# Altium schematic sheet ArbPwrBoost_P3.SchDoc: =ProjectTitle
size B; Engineer: Hab Collector; Organization: Altium Limited; Address1: 3621 Gin Way; Address2: Snellville, GA 30039; SheetNumber: 3; SheetTotal: 8
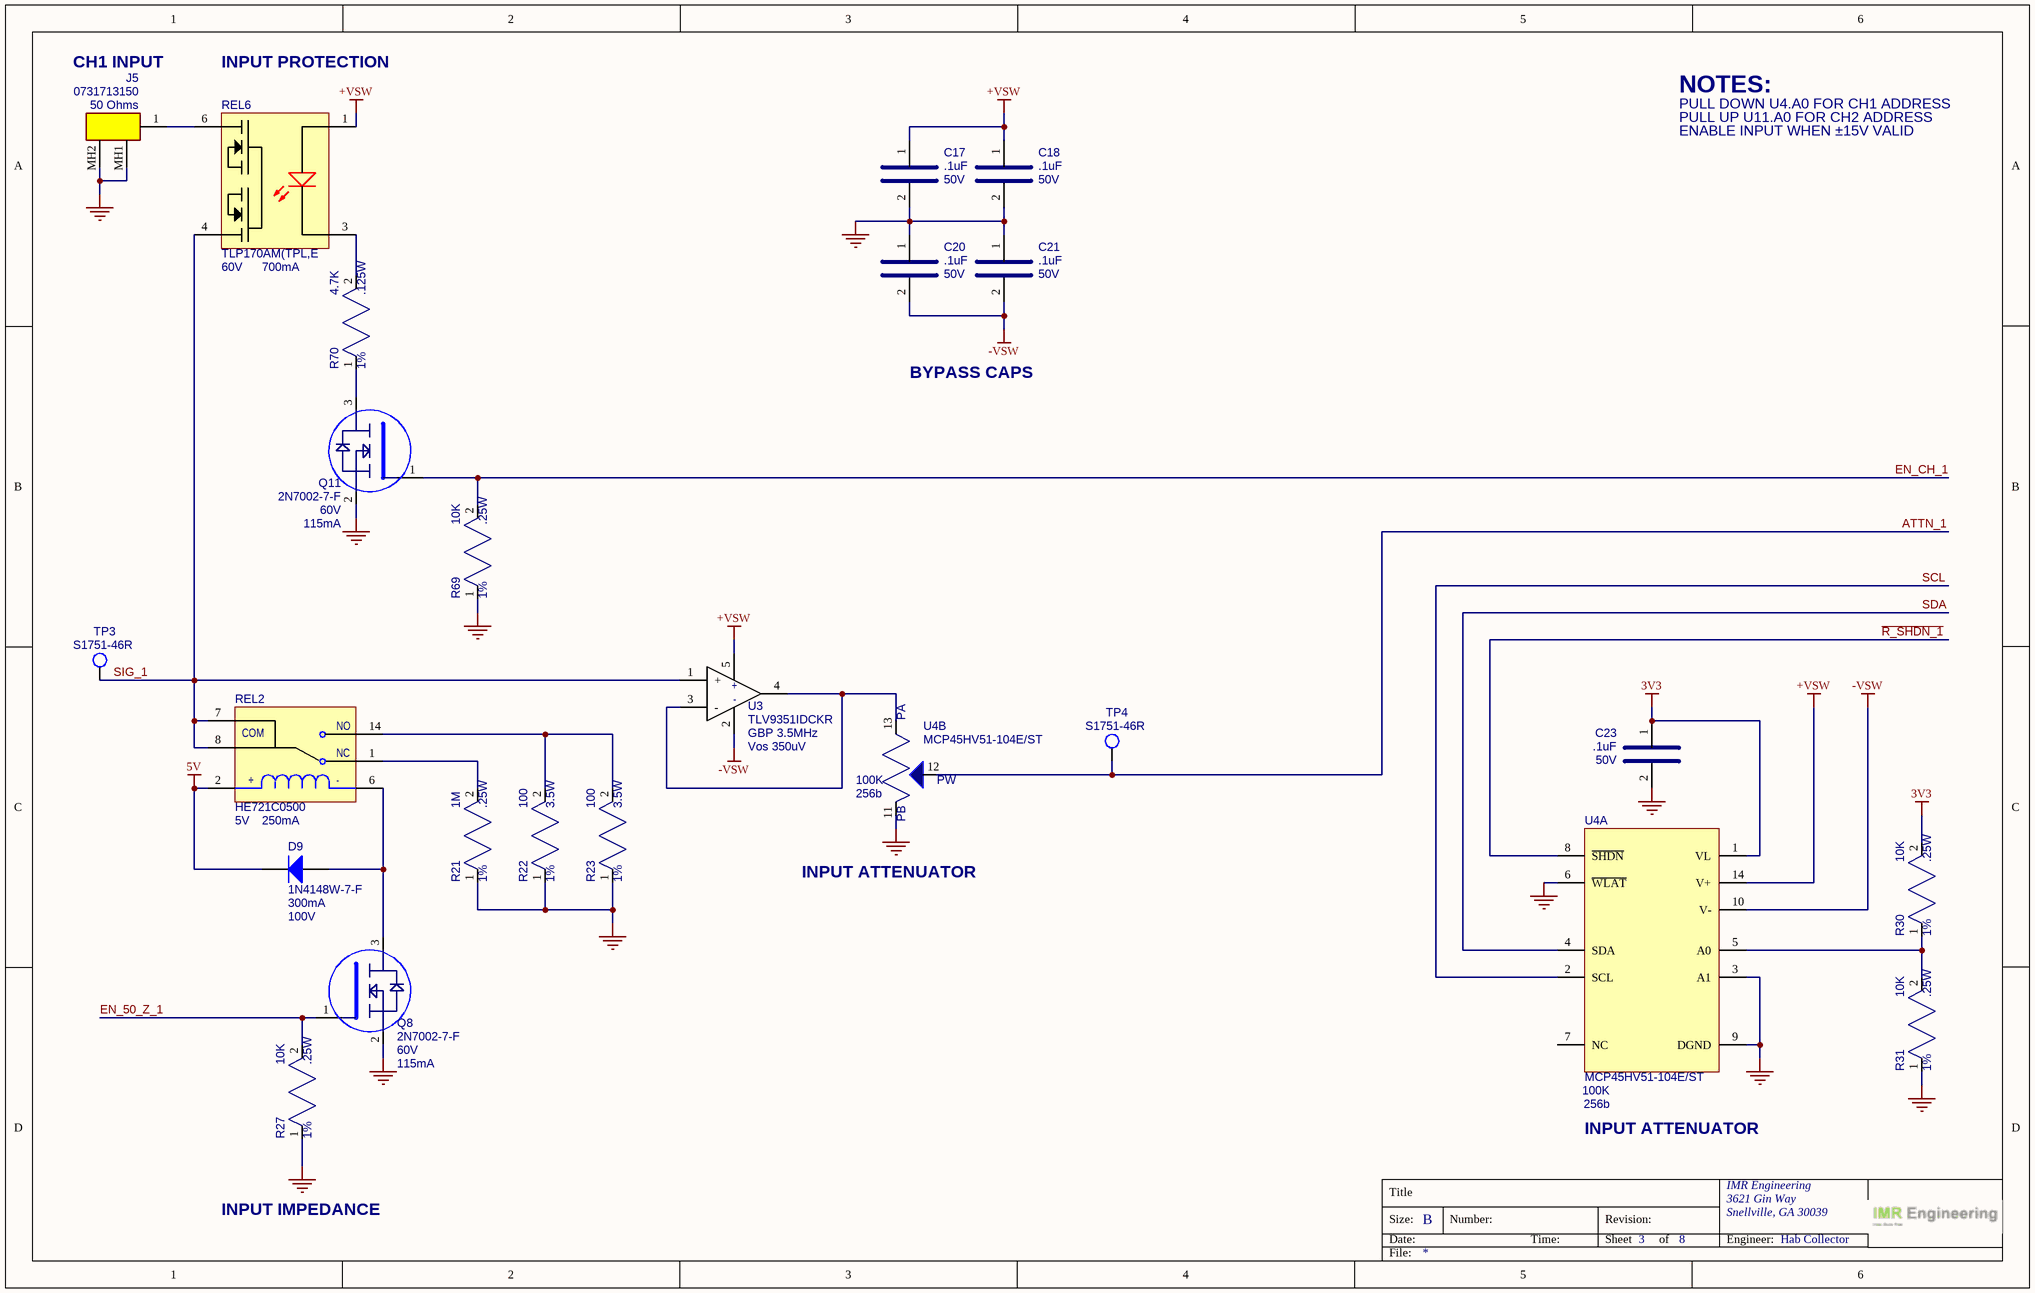
[diagram p0: ArbPwrBoost_P3.SchDoc]

## Parts
C17  value .1uF  Voltage: 50V  [CAP_0805]  (hidden comment: KGM21NR71H104KT)
C18  value .1uF  Voltage: 50V  [CAP_0805]  (hidden comment: KGM21NR71H104KT)
C20  value .1uF  Voltage: 50V  [CAP_0805]  (hidden comment: KGM21NR71H104KT)
C21  value .1uF  Voltage: 50V  [CAP_0805]  (hidden comment: KGM21NR71H104KT)
C23  value .1uF  Voltage: 50V  [CAP_0805]  (hidden comment: KGM21NR71H104KT)
D9  value 100V  Current: 300mA  [SOD123]  (hidden comment: 1N4148W-7-F)
J5  value 50 Ohms  [731713150]  (hidden comment: 0731713150)
Q8  value 60V  Current: 115mA  [SOT-23]  (hidden comment: 2N7002-7-F)
Q11  value 60V  Current: 115mA  [SOT-23]  (hidden comment: 2N7002-7-F)
R21  value 1M  Power: .25W  Tolerance: 1%  [RES_0805]  (hidden comment: RC0805FR-7W1ML)
R22  value 100  Power: 3.5W  Tolerance: 1%  [RES_2512]  (hidden comment: ALN2512F100RE-1)
R23  value 100  Power: 3.5W  Tolerance: 1%  [RES_2512]  (hidden comment: ALN2512F100RE-1)
R27  value 10K  Power: .25W  Tolerance: 1%  [RES_0805]  (hidden comment: RC0805FR-7W10KL)
R30  value 10K  Power: .25W  Tolerance: 1%  [RES_0805]  (hidden comment: RC0805FR-7W10KL)
R31  value 10K  Power: .25W  Tolerance: 1%  [RES_0805]  (hidden comment: RC0805FR-7W10KL)
R69  value 10K  Power: .25W  Tolerance: 1%  [RES_0805]  (hidden comment: RC0805FR-7W10KL)
R70  value 4.7K  Power: .125W  Tolerance: 1%  [RES_0805]  (hidden comment: RC0805FR-134K7L)
REL2  value 5V  Current: 250mA  [HE700]  (hidden comment: HE721C0500)
REL6  value 60V  Current: 700mA  [SOP-6]  (hidden comment: TLP170AM(TPL,E)
TP3  S1751-46R  [HARWIN_S1751]
TP4  S1751-46R  [HARWIN_S1751]
U3  value GBP 3.5MHz  Vos: Vos 350uV  [SOT-353]  (hidden comment: TLV9351IDCKR)
U4  value 100K  TAP: 256b  [TSSOP-14]  (hidden comment: MCP45HV51-104E/ST)  (parts A,B of 2)

## Nets
3V3: C23.1 R30.2 U4.1(VL)
5V: D9.2(K) REL2.2
+VSW: C17.1 C18.1 REL6.1 U3.5 U4.14(V+)
-VSW: C20.2 C21.2 U3.2 U4.10(V-)
GND: C17.2 C18.2 C20.1 C21.1 C23.2 J5.MH1 J5.MH2 Q8.2(E) Q11.2(E) R21.1 R22.1 R23.1 R27.1 R31.1 R69.1 U4.3(A1) U4.6(~{WLAT}) U4.9(DGND) U4.11(PB0)
~{R_SHDN_1}: U4.8(~{SHDN})
ATTN_1: TP4.1 U4.12(PW0)
EN_50_Z_1: Q8.1(B) R27.2
EN_CH_1: Q11.1(B) R69.2
SCL: U4.2(SCL)
SDA: U4.4(SDA)
SIG_1: REL2.7(COM) REL2.8(COM) REL6.4 TP3.1 U3.1(+)
NetD9_1: D9.1(A) Q8.3(C) REL2.6
NetJ5_1: J5.1 REL6.6
NetQ11_3: Q11.3(C) R70.1
NetR21_2: R21.2 REL2.1(NC)
NetR22_2: R22.2 R23.2 REL2.14(NO)
NetR30_1: R30.1 R31.2 U4.5(A0)
NetR70_2: R70.2 REL6.3
NetU3_3: U3.3(-) U3.4 U4.13(PA)

Not connected (* = marked no-connect by the designer): U4 7(NC)

## Notes on the sheet
- CH1 INPUT
- INPUT PROTECTION
- NOTES:
- PULL DOWN U4.A0 FOR CH1 ADDRESS
- PULL UP U11.A0 FOR CH2 ADDRESS
- ENABLE INPUT WHEN ±15V VALID
- BYPASS CAPS
- INPUT ATTENUATOR
- INPUT IMPEDANCE
- Title
- Size:
- Date:
- B
- Number:
- Time:
- Revision:
- Sheet
- of
- IMR Engineering
- Engineer:
- File:
- (in symbol IC_MCP45HV51-104E/ST, part B) PW; PB
- (in symbol RELAY_HE721C0500) +; -

## Library data of the parts
C17 C18 C20 C21 C23 = CAP_SMD_0.1UF_50V_0805: CAP CER 0.1UF 50V X7R 0805; MFG: KYOCERA AVX; Case/Package: 0805; MFG_PN: KGM21NR71H104KT; Supplier 1: DigiKey; Supplier Part Number 1: 478-KGM21NR71H104KTCT-ND; Unit Price: .1
D9 = DIODE_1N4148W-7-F: RELAY REED SPDT 250MA 5V; MFG: Diodes Inc; Case/Package: SOD-123; Supplier 1: DigiKey; Supplier Part Number 1: 1N4148W-FDICT-ND; Unit Price: .16; MFG_PN: 1N4148W-7-F
J5 = CONN_MOLEX_0731713150: CONN BNC RCPT R/A 50 OHM PCB; MFG: Molex; Case/Package: 73099-2; Supplier 1: DigiKey; Supplier Part Number 1: WM20430-ND; Unit Price: 1.40; MFG_PN: 0731713150
Q8 Q11 = MOSFET_NCH_2N7002-7-F: MOSFET N-CH 60V 115MA SOT23-3; MFG: Diodes Inc; Case/Package: SOT-23; Supplier 1: DigiKey; Supplier Part Number 1: 2N7002-FDICT-ND; Unit Price: .20; MFG_PN: 2N7002-7-F
R21 = RES_SMD_1M_0805_1/4W_1%: RES SMD 1K OHM 1% 1/4W 0805; MFG: Yageo; Case/Package: 0805; MFG_PN: RC0805FR-7W1ML; Supplier 1: DigiKey; Supplier Part Number 1: 13-RC0805FR-7W1MLCT-ND; Unit Price: .10
R22 R23 = RES_SMD_100_0805_3.5W_1%: RES SMD 100 OHM 1% 3.5W 2512; MFG: Ohmite; Case/Package: 2512; MFG_PN: ALN2512F100RE-1; Supplier 1: DigiKey; Supplier Part Number 1: 273-ALN2512F100RE-1CT-ND; Unit Price: 1.50
R27 R30 R31 R69 = RES_SMD_10K_0805_1/4W_1%: RES SMD 10K OHM 1% 1/4W 0805; MFG: Yageo; Case/Package: 0805; MFG_PN: RC0805FR-7W10KL; Supplier 1: DigiKey; Supplier Part Number 1: 13-RC0805FR-7W10KLCT-ND; Unit Price: .10
R70 = RES_SMD_4.7K_0805_1/8W_1%: RES SMD 4.7K OHM 1% 1/8W 0805; MFG: Yageo; Case/Package: 0805; MFG_PN: RC0805FR-134K7L; Supplier 1: DigiKey; Supplier Part Number 1: 13-RC0805FR-134K7LCT-ND; Unit Price: .1
REL2 = RELAY_HE721C0500: RELAY REED SPDT 250MA 5V; MFG: Littlefuse; Case/Package: HE700; Supplier 1: DigiKey; Supplier Part Number 1: HE112-ND; Unit Price: 3.77; MFG_PN: HE721C0500
REL6 = RELAY_TLP170AM(TPL,E: SSR RELAY SPST-NO 700MA 0-60V; MFG: Toshiba; Case/Package: SOP-6; Supplier 1: DigiKey; Supplier Part Number 1: 264-TLP170AM(TPLECT-ND; Unit Price: 1.33; MFG_PN: TLP170AM(TPL,E
TP3 TP4 = CONN_TEST_POINT_S1751-46R: PCB TEST POINT CONNECT; MFG: Harwin Inc; Case/Package: S1751; MFG_PN: S1751-46R; Supplier 1: Digi-Key; Supplier Part Number 1: 952-1478-1-ND; Value: *; Unit Price: .28
U3 = OPAMP_TLV9351IDCKR: IC OPAMP GP 3.5MHZ 350uV C70-5; MFG: Texas Instruments; Package/Case: SOT-353; Supplier 1: DigiKey; MFG_PN: TLV9351IDCKR; Unit Price: .49; Supplier Part Number 1: 296-TLV9351IDCKRCT-ND
U4 = IC_MCP45HV51-104E/ST: IC DGT POT 100KOHM 256TP 14TSSOP; MFG: Microchip; Case/Package: TSSOP-14; Supplier 1: DigiKey; Supplier Part Number 1: MCP45HV51-104E/ST-ND; Unit Price: 2.00; MFG_PN: MCP45HV51-104E/ST